# EAGLE design IRDetector (EAGLE 7.5.0)
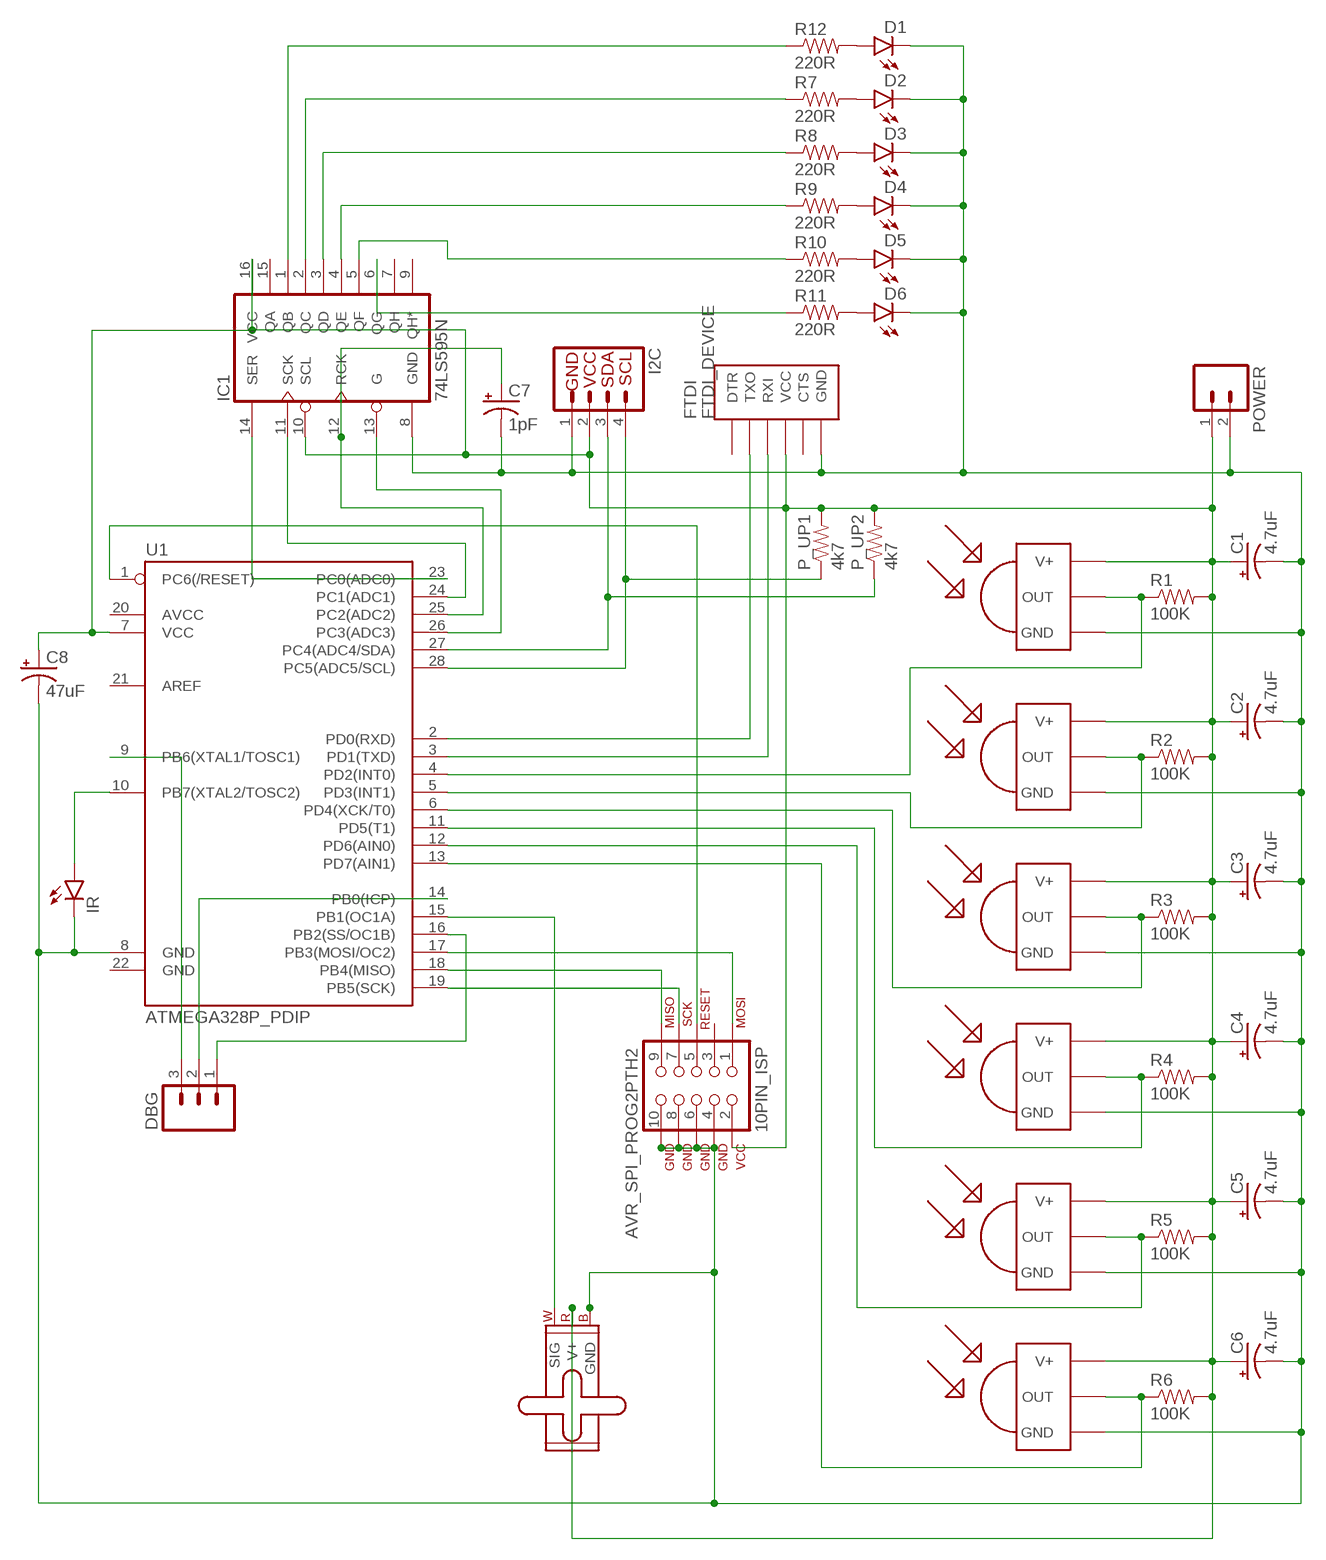
[diagram p0: schematic, sheet 1]

## Parts
10PIN_ISP  AVR_SPI_PROG2PTH2  [2X5-SHROUDED]
C1  4.7uF  CAP_POLPTH2  [CPOL-RADIAL-10UF-25V]
C2  4.7uF  CAP_POLPTH2  [CPOL-RADIAL-10UF-25V]
C3  4.7uF  CAP_POLPTH2  [CPOL-RADIAL-10UF-25V]
C4  4.7uF  CAP_POLPTH2  [CPOL-RADIAL-10UF-25V]
C5  4.7uF  CAP_POLPTH2  [CPOL-RADIAL-10UF-25V]
C6  4.7uF  CAP_POLPTH2  [CPOL-RADIAL-10UF-25V]
C7  1pF  CAP_POLPTH2  [CPOL-RADIAL-10UF-25V]
C8  47uF  CAP_POLPTH2  [CPOL-RADIAL-10UF-25V]
D1  LED5MM  [LED5MM]
D2  LED5MM  [LED5MM]
D3  LED5MM  [LED5MM]
D4  LED5MM  [LED5MM]
D5  LED5MM  [LED5MM]
D6  LED5MM  [LED5MM]
DBG  M03PTH  [1X03]
FTDI  FTDI_DEVICE  [FTDI_DEVICE_SIDE]
I2C  I2C_STANDARD  [1X04]
IC1  74LS595N  [DIL16]
IR  LED5MM  [LED5MM]
IRD1  TSOP4838  [TSOP18XX]
IRD2  TSOP4838  [TSOP18XX]
IRD3  TSOP4838  [TSOP18XX]
IRD4  TSOP4838  [TSOP18XX]
IRD5  TSOP4838  [TSOP18XX]
IRD6  TSOP4838  [TSOP18XX]
M1  SMALL_SERVO  [1X03]
P_UP1  4k7  RESISTORPTH-1/6W  [1/6W-RES]
P_UP2  4k7  RESISTORPTH-1/6W  [1/6W-RES]
POWER  M02JST-PTH-VERT  [JST-2-PTH-VERT]
R1  100K  RESISTORPTH-1/6W  [1/6W-RES]
R2  100K  RESISTORPTH-1/6W  [1/6W-RES]
R3  100K  RESISTORPTH-1/6W  [1/6W-RES]
R4  100K  RESISTORPTH-1/6W  [1/6W-RES]
R5  100K  RESISTORPTH-1/6W  [1/6W-RES]
R6  100K  RESISTORPTH-1/6W  [1/6W-RES]
R7  220R  RESISTORPTH-1/6W  [1/6W-RES]
R8  220R  RESISTORPTH-1/6W  [1/6W-RES]
R9  220R  RESISTORPTH-1/6W  [1/6W-RES]
R10  220R  RESISTORPTH-1/6W  [1/6W-RES]
R11  220R  RESISTORPTH-1/6W  [1/6W-RES]
R12  220R  RESISTORPTH-1/6W  [1/6W-RES]
U1  ATMEGA328P_PDIP  [DIL28-3]

## Nets
N$1: 10PIN_ISP.4(GND) 10PIN_ISP.6(GND) 10PIN_ISP.8(GND) 10PIN_ISP.10(GND) C1.2(-) C2.2(-) C3.2(-) C4.2(-) C5.2(-) C6.2(-) C7.2(-) C8.2(-) D1.K(C) D2.K(C) D3.K(C) D4.K(C) D5.K(C) D6.K(C) FTDI.P$6(GND) I2C.1 IC1.8(GND) IR.K(C) IRD1.GND IRD2.GND IRD3.GND IRD4.GND IRD5.GND IRD6.GND M1.3(GND) POWER.2 U1.8(GND)
N$2: 10PIN_ISP.2(VCC) C1.1(+) C2.1(+) C3.1(+) C4.1(+) C5.1(+) C6.1(+) C8.1(+) FTDI.P$4(VCC) I2C.2 IC1.10(SCL) IC1.16(VCC) IRD1.VCC(V+) IRD2.VCC(V+) IRD3.VCC(V+) IRD4.VCC(V+) IRD5.VCC(V+) IRD6.VCC(V+) M1.2(V+) P_UP1.2 P_UP2.2 POWER.1 R1.2 R2.2 R3.2 R4.2 R5.2 R6.2 U1.7(VCC)
N$3: IRD1.OUT R1.1 U1.4(PD2(INT0))
N$4: IRD2.OUT R2.1 U1.5(PD3(INT1))
N$5: IRD3.OUT R3.1 U1.6(PD4(XCK/T0))
N$6: IRD4.OUT R4.1 U1.11(PD5(T1))
N$7: IRD5.OUT R5.1 U1.12(PD6(AIN0))
N$8: IRD6.OUT R6.1 U1.13(PD7(AIN1))
N$9: FTDI.P$2(TXO) U1.2(PD0(RXD))
N$10: FTDI.P$3(RXI) U1.3(PD1(TXD))
N$11: 10PIN_ISP.5(RESET) U1.1(PC6(/RESET))
N$12: 10PIN_ISP.9(MISO) U1.18(PB4(MISO))
N$13: 10PIN_ISP.1(MOSI) U1.17(PB3(MOSI/OC2))
N$14: M1.1(SIG) U1.15(PB1(OC1A))
N$15: 10PIN_ISP.7(SCK) U1.19(PB5(SCK))
N$16: IC1.13(G) U1.26(PC3(ADC3))
N$17: C7.1(+) IC1.12(RCK) U1.25(PC2(ADC2))
N$18: IC1.11(SCK) U1.24(PC1(ADC1))
N$19: IC1.1(QB) R12.1
N$20: IC1.14(SER) U1.23(PC0(ADC0))
N$21: I2C.4 P_UP1.1 U1.28(PC5(ADC5/SCL))
N$22: I2C.3 P_UP2.1 U1.27(PC4(ADC4/SDA))
N$23: IC1.2(QC) R7.1
N$24: IC1.3(QD) R8.1
N$25: IC1.4(QE) R9.1
N$26: D1.A R12.2
N$27: D2.A R7.2
N$28: D3.A R8.2
N$29: D4.A R9.2
N$30: D5.A R10.2
N$31: D6.A R11.2
N$32: IR.A U1.10(PB7(XTAL2/TOSC2))
N$33: DBG.1 U1.16(PB2(SS/OC1B))
N$34: DBG.2 U1.14(PB0(ICP))
N$35: IC1.5(QF) R10.1
N$36: IC1.6(QG) R11.1
N$37: DBG.3 U1.9(PB6(XTAL1/TOSC1))
Unconnected: 10PIN_ISP.3(NC) FTDI.P$1(DTR) FTDI.P$5(CTS) IC1.7(QH) IC1.9(QH*) IC1.15(QA) U1.20(AVCC) U1.21(AREF) U1.22(GND)

## Library data of the parts
10PIN_ISP = SparkFun-Connectors:AVR_SPI_PROG2: AVR 10-pin ICSP Header This is the standard AVR In Circuit Serial Programming header. Minimal, but includes pin one indicator. Works with standard Olimex programmers. Also look for the 6-pin reduced version. Spark Fun Electronics SKU: PRT-00778
C1-C8 = SparkFun-Capacitors:CAP_POL: Capacitor Polarized These are standard SMD and PTH capacitors. Normally 10uF, 47uF, and 100uF in electrolytic and tantalum varieties. Always verify the external diameter of the through hole cap, it varies with capacity, voltage, and manufacturer. The EIA devices should be standard.
D1-D6 IR = SparkFun-LED:LED: LEDs Standard schematic elements and footprints for 5mm, 3mm, 1206, and 0603 sized LEDs. 5mm - Spark Fun Electronics SKU : COM-00529 (and others)
DBG = SparkFun-Connectors:M03: Header 3 Standard 3-pin 0.1" header. Use with straight break away headers (SKU : PRT-00116), right angle break away headers (PRT-00553), swiss pins (PRT-00743), machine pins (PRT-00117), and female headers (PRT-00115). Molex polarized connector foot print use with SKU : PRT-08232 with associated crimp pins and housings.
FTDI = SparkFun-Connectors:FTDI_DEVICE: Connector which mates to FTDI basic or FTDI cable.
I2C = SparkFun-Connectors:I2C_STANDARD: SparkFun has standardized on a pinout for all I2C based sensor breakouts. This pinout allows I2C boards to be plugged directly into the headers on Arduino Uno compatible boards, and to be daisy chained easily.
IC1 = SparkFun-DigitalIC:74*595: 8-bit SHIFT REGISTER, output latch
IRD1-IRD6 = tsop:TSOP4838: IR Receiver and Demodulator
M1 = SparkFun-Electromechanical:SMALL_SERVO: Small servo motor This is the small servo used in the SIK. SKU: ROB-09065
P_UP1 P_UP2 R1-R12 = SparkFun-Resistors:RESISTOR: Resistor Basic schematic elements and footprints for 0603, 1206, and PTH resistors.
POWER = SparkFun-Connectors:M02: Standard 2-pin 0.1" header. Use with - straight break away headers ( PRT-00116) - right angle break away headers (PRT-00553) - swiss pins (PRT-00743) - machine pins (PRT-00117) - female headers (PRT-00115) Molex polarized connector foot print use with: PRT-08233 with associated crimp pins and housings. 2.54_SCREWTERM for use with PRT-10571. 3.5mm Screw Terminal footprints for PRT-08084 5mm Screw Terminal footprints for use with PRT-08432
U1 = SparkFun-DigitalIC:ATMEGA328P_PDIP: uC used in the Arduino 32kb flash, 1k EEPROM, 2k SRAM This is the through-hole version of this chip.

## Board
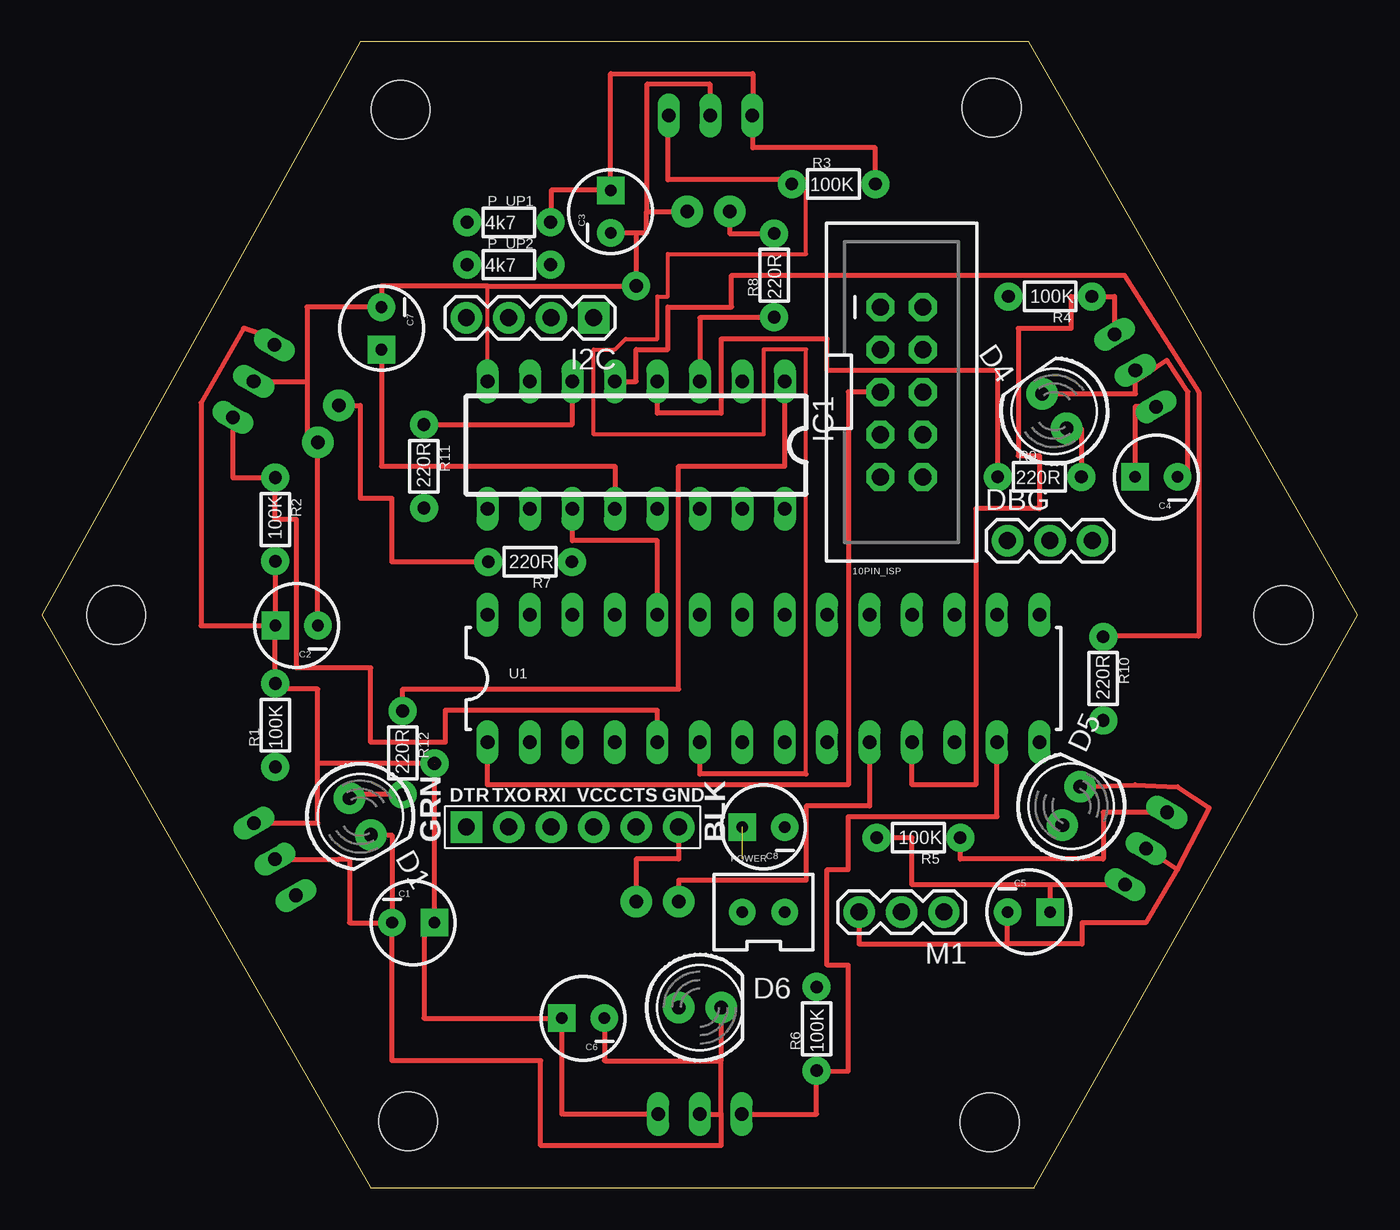
[diagram p1: board, top side]
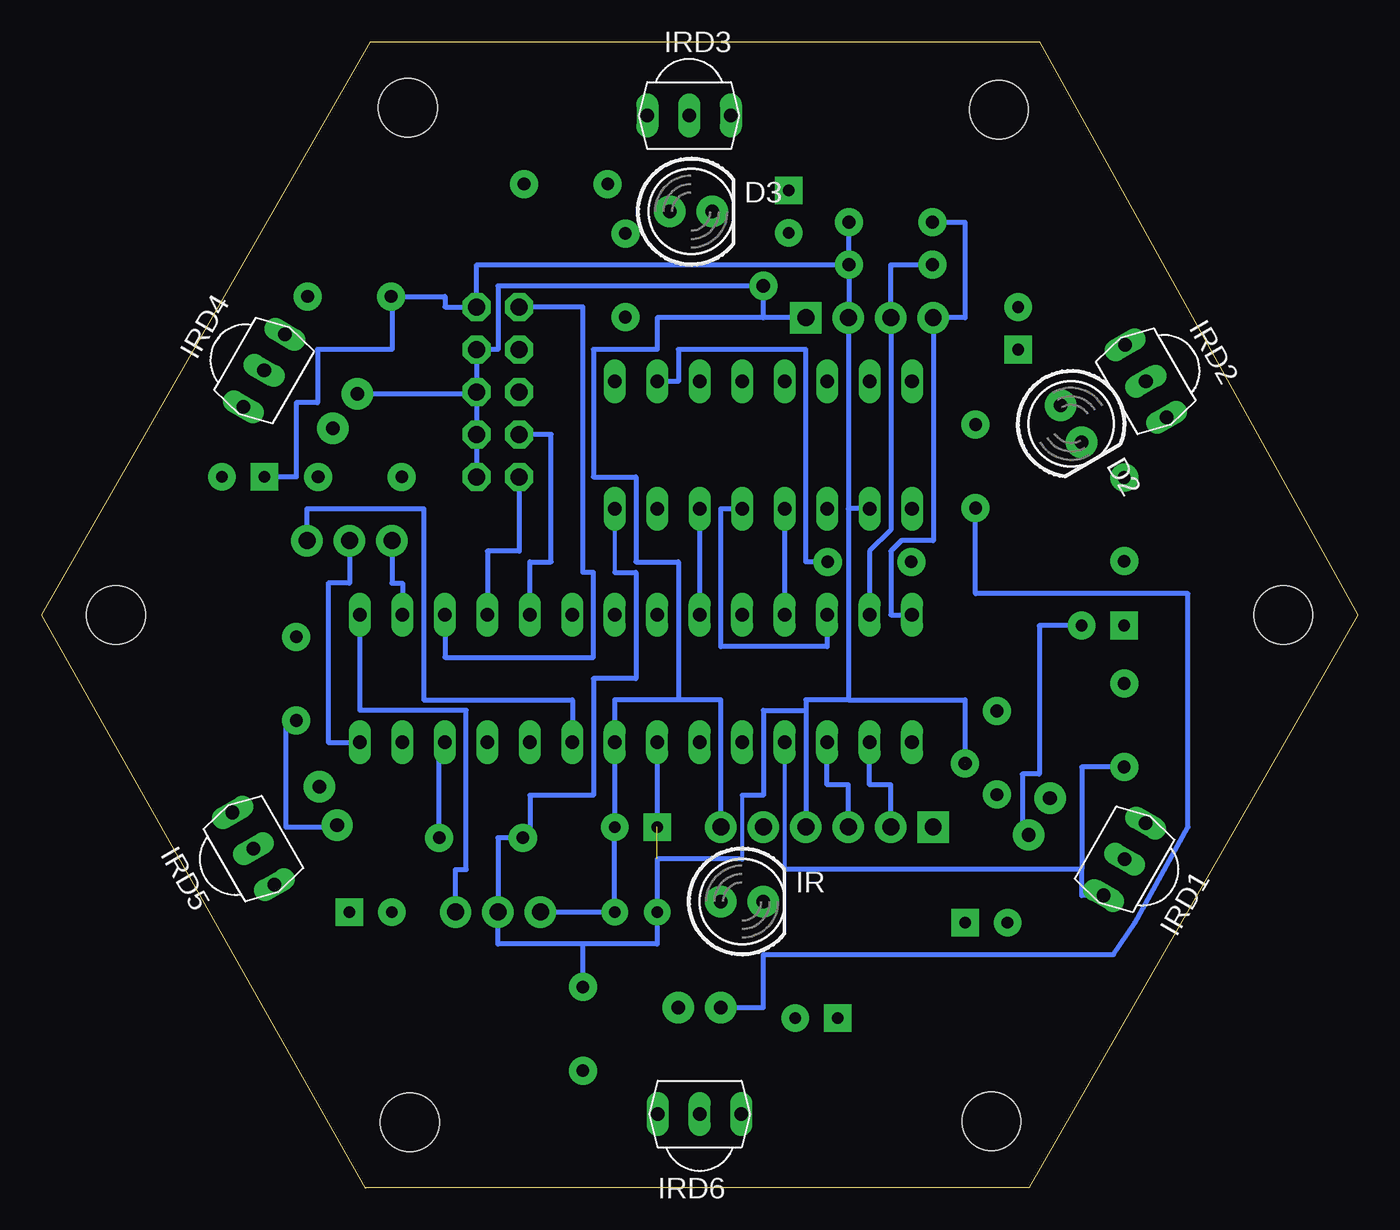
[diagram p2: board, bottom side, seen from below]

Size 78.73 x 68.59 mm. Coordinates in mm from the lower left corner, seen from the top.
Outline: 19.05,68.59 59.05,68.59 78.73,34.29 59.36,0 59.36,0.01 19.68,0.01 0,34.29 19.04,68.58
Copper layers (1*16): Top 0.035mm / dielectric 1.5mm / Bottom 0.035mm
Design rules "default": minimum track width 10mil, minimum drill 24mil, track to track 8mil, track to pad 8mil, pad to pad 8mil, via to via 8mil, smd to smd 8mil, copper to edge 40mil, drill to drill 8mil, minimum pad ring 10mil, minimum via ring 8mil, stop-mask expansion 4mil, vias tented up to drill 0mil, thermal gap 10mil
Holes 3.5 mm at 4.45,34.3 74.29,34.3 21.46,64.53 56.83,64.65 56.71,3.95 21.91,4.01

### Footprints (pad centres in the part's own frame; a part is rotated, then mirrored left to right if it is on the bottom)
2X5-SHROUDED = drill 1.016 pad 1.676 octagon: 1 -1.27,5.08; 2 1.27,5.08; 3 -1.27,2.54; 4 1.27,2.54; 5 -1.27,0; 6 1.27,0; 7 -1.27,-2.54; 8 1.27,-2.54; 9 -1.27,-5.08; 10 1.27,-5.08
CPOL-RADIAL-10UF-25V = drill 0.7 pad 1.651 square: 1 1.27,0 | drill 0.7 pad 1.651: 2 -1.27,0
LED5MM = drill 0.813 pad 1.88: A -1.27,0; K 1.27,0
1X03 = drill 1.016 pad 1.88: 1 0,0; 2 2.54,0; 3 5.08,0
FTDI_DEVICE_SIDE = drill 1.016 pad 1.88 square: P$1 -6.35,0 | drill 1.016 pad 1.88: P$2 -3.81,0; P$3 -1.27,0; P$4 1.27,0; P$5 3.81,0; P$6 6.35,0
1X04 = drill 1.016 pad 1.88 square: 1 0,0 | drill 1.016 pad 1.88: 2 2.54,0; 3 5.08,0; 4 7.62,0
DIL16 = drill 0.813 long: 1 -8.89,-3.81; 2 -6.35,-3.81; 3 -3.81,-3.81; 4 -1.27,-3.81; 5 1.27,-3.81; 6 3.81,-3.81; 7 6.35,-3.81; 8 8.89,-3.81; 9 8.89,3.81; 10 6.35,3.81; 11 3.81,3.81; 12 1.27,3.81; 13 -1.27,3.81; 14 -3.81,3.81; 15 -6.35,3.81; 16 -8.89,3.81
TSOP18XX = drill 0.813 long: GND -0.001,-0.027; OUT -2.501,-0.027; VCC 2.499,-0.027
1/6W-RES = drill 0.762 pad 1.676: 1 -2.5,0; 2 2.5,0
JST-2-PTH-VERT = drill 0.7 pad 1.6: 1 -1.27,0; 2 1.27,0
DIL28-3 = drill 0.813 long: 1 -16.51,-3.81; 2 -13.97,-3.81; 3 -11.43,-3.81; 4 -8.89,-3.81; 5 -6.35,-3.81; 6 -3.81,-3.81; 7 -1.27,-3.81; 8 1.27,-3.81; 9 3.81,-3.81; 10 6.35,-3.81; 11 8.89,-3.81; 12 11.43,-3.81; 13 13.97,-3.81; 14 16.51,-3.81; 15 16.51,3.81; 16 13.97,3.81; 17 11.43,3.81; 18 8.89,3.81; 19 6.35,3.81; 20 3.81,3.81; 21 1.27,3.81; 22 -1.27,3.81; 23 -3.81,3.81; 24 -6.35,3.81; 25 -8.89,3.81; 26 -11.43,3.81; 27 -13.97,3.81; 28 -16.51,3.81

### Placement (x,y rotation side)
10PIN_ISP  51.44,47.63 0 top
C1  22.23,15.88 0 top
C2  15.24,33.66 180 top
C3  34.04,58.43 90 top
C4  66.68,42.55 180 top
C5  59.05,16.52 0 top
C6  32.38,10.17 180 top
C7  20.32,51.45 270 top
C8  43.18,21.6 180 top
D1  19.05,22.23 300 top
D2  17.14,45.73 300 bottom
D3  39.88,58.43 0 bottom
D4  60.58,46.49 125 top
D5  61.6,22.87 65 top
D6  39.37,10.81 0 top
DBG  57.79,38.74 0 top
FTDI  31.75,21.6 0 top
I2C  33.02,52.08 180 top
IC1  35.56,44.46 180 top
IR  36.83,17.16 0 bottom
IRD1  13.97,19.7 60 bottom
IRD2  12.7,48.27 120 bottom
IRD3  40.01,64.15 180 bottom
IRD4  65.41,48.91 240 bottom
IRD5  66.04,20.33 300 bottom
IRD6  39.37,4.46 0 bottom
M1  53.98,16.52 180 top
P_UP1  27.94,57.79 0 top
P_UP2  27.94,55.25 0 top
POWER  43.18,16.52 0 top
R1  13.97,27.7 90 top
R2  13.97,40.02 270 top
R3  47.37,60.08 0 top
R4  60.32,53.35 180 top
R5  52.45,20.97 180 top
R6  46.35,9.54 90 top
R7  29.21,37.48 180 top
R8  43.81,54.62 90 top
R9  59.69,42.55 0 top
R10  63.5,30.49 270 top
R11  22.86,43.19 270 top
R12  21.59,26.05 270 top
U1  43.18,30.49 0 top

### Tracks (layer width: path | path; a pad name or v marks a point on that pad's centre or on a via)
N$1  (via drill 0.8 pad 1.68)
  Top 0.254: IC1.8 26.67,53.98
  Top 0.305: IRD3.GND 40,66.05 | 40,66.05 40.01,66.05 | 40,66.05 36.2,66.05 36.2,58.43 | 36.2,58.43 D3.K | 35.56,57.16 36.2,57.16 36.2,58.43 | C3.2 35.56,57.16 | 35.56,57.16 v35.56,53.98 26.67,53.98 20.32,53.98 C7.2 15.88,52.71 15.88,48.27 | IRD2.GND 12.68,48.27 15.88,48.27 | 15.88,48.27 15.88,44.63 D2.K C2.2 | D1.K 20.95,21.13 C1.2 | IRD1.GND 17.78,19.68 17.78,19.7 18.41,19.7 18.41,15.88 C1.2 | IRD6.GND 40.64,4.43 | 40.64,4.43 40.64,7.63 | C6.2 33.66,7.63 40.64,7.63 | D6.K 40.64,7.63 | 40.64,4.43 40.64,2.55 29.84,2.55 29.84,7.63 20.95,7.63 C1.2 | 57.79,14.62 62.23,14.62 62.23,15.88 66.04,15.88 67.94,19.06 | 57.79,14.62 C5.2 | D5.K 65.41,24.14 67.94,24.02 69.85,22.75 67.94,19.06 | IRD5.GND 66.06,20.33 67.94,19.06 | D4.K 65.43,47.53 65.43,48.27 | 65.43,48.27 IRD4.GND | M1.3 48.9,14.62 57.79,14.62 | FTDI.P$6 38.1,19.7 35.56,19.7 IR.K | C4.2 68.58,42.55 68.58,47.63 67.31,49.54 65.43,48.27
  Bottom 0.305: FTDI.P$6 38.1,29.22 40.64,29.22 | 40.64,29.22 44.45,29.22 U1.8 C8.2 POWER.2 M1.3 | 10PIN_ISP.6 10PIN_ISP.4 51.44,50.17 51.44,53.98 v35.56,53.98 35.56,52.08 | 10PIN_ISP.6 10PIN_ISP.8 10PIN_ISP.10 | 40.64,29.22 40.64,37.48 43.18,37.48 43.18,42.55 45.72,42.55 45.72,50.17 41.91,50.17 41.91,52.08 35.56,52.08 | I2C.1 35.56,52.08 | C2.2 19.05,33.66 19.05,24.77 20.07,24.77 20.07,21.13 D1.K | D4.K 52.71,47.53 10PIN_ISP.6
N$2  (2 unrouted)
  Top 0.305: R3.2 49.87,62.24 42.55,62.24 42.55,64.17 | 42.55,64.17 42.55,66.69 34.04,66.69 C3.1 30.48,59.7 30.48,57.79 P_UP1.2 | 42.55,64.17 IRD3.VCC | IRD2.VCC 13.93,50.81 12.07,51.45 9.52,47 9.52,33.66 C2.1 | R2.2 C2.1 | C2.1 R1.2 13.97,29.85 16.51,29.85 16.51,25.41 | IRD1.VCC 16.51,21.85 16.51,25.41 | IRD6.VCC 31.12,4.43 C6.1 22.86,10.17 22.86,15.88 C1.1 23.49,25.41 16.51,25.41 | C5.1 60.32,18.15 IRD5.VCC 52.07,18.15 52.07,20.97 R5.2 | IRD4.VCC 65.41,46.75 C4.1
  Bottom 0.254: 36.83,23.51 36.83,19.7 | IC1.16 44.45,36.84
  Bottom 0.305: U1.7 C8.1 | 36.83,23.51 35.56,23.51 35.56,28.59 33.02,28.59 | 36.83,19.7 41.91,19.7 POWER.1 41.91,14.62 46.35,14.62 | 44.45,36.84 43.18,36.84 43.18,30.49 45.72,30.49 45.72,23.51 49.53,23.51 49.53,20.97 R5.2 51.44,20.97 M1.2 51.44,14.62 46.35,14.62 | 30.48,40.65 I2C.2 30.44,51.45 P_UP2.2 | 30.48,40.65 30.48,29.22 | 30.48,29.22 33.02,29.22 33.02,28.59 | 33.02,28.59 FTDI.P$4 | P_UP2.2 P_UP1.2 | P_UP2.2 52.71,55.25 10PIN_ISP.2 54.61,52.71 54.61,53.35 57.79,53.35 | 30.48,29.22 23.49,29.22 23.49,25.41 | R6.2 46.35,14.62 | R4.2 57.79,53.35 | 57.79,53.35 57.79,50.17 62.23,50.17 62.23,47 63.5,47 63.5,42.55 C4.1 | IC1.10 30.48,40.65
N$3
  Bottom 0.254: U1.4 34.29,19.06
  Bottom 0.305: R1.1 16.51,25.2 16.51,19.06 | 16.51,19.06 34.29,19.06 | IRD1.OUT 16.51,17.52 16.51,19.06
N$4
  Top 0.305: IRD2.OUT 11.43,42.52 R2.1 13.97,40.02 15.24,40.02 15.24,31.12 19.68,31.12 19.68,26.68 24.13,26.68 24.13,28.59 36.83,28.59 U1.5
N$5
  Top 0.254: 45.72,24.77 45.72,50.17 43.18,50.17 43.18,45.09 33.02,45.09 33.02,50.17 34.29,50.17 34.92,50.81 36.83,50.81 36.83,53.35 37.47,53.35 37.47,55.89 45.72,55.89 45.72,60.34 44.45,60.34
  Top 0.305: 44.87,60.34 44.45,60.34 37.47,60.34 37.47,64.17 IRD3.OUT | R3.1 44.87,60.34 | 44.87,60.34 45.72,60.34 | 45.72,24.77 39.37,24.77 U1.6
N$6
  Top 0.305: IRD4.OUT 64.18,53.35 R4.1 61.6,53.35 61.6,51.45 58.42,51.45 58.42,43.82 59.69,43.82 59.69,40.65 55.88,40.65 55.88,24.14 52.07,24.14 U1.11
N$7
  Top 0.305: IRD5.OUT 63.5,22.48 63.5,19.7 54.95,19.7 R5.1
  Bottom 0.305: R5.1 54.95,26.68 U1.12
N$8
  Top 0.305: IRD6.OUT 46.35,4.43 R6.1 46.99,7.04 48.26,7 48.26,13.35 46.99,13.35 46.99,19.06 48.26,19.06 48.26,22.23 57.15,22.23 U1.13
N$9
  Bottom 0.305: FTDI.P$2 27.94,24.14 29.21,24.14 U1.2
N$10
  Bottom 0.305: FTDI.P$3 30.48,24.14 31.75,24.14 U1.3
N$11
  Top 0.305: 10PIN_ISP.5 48.26,47.63 48.26,24.14 26.67,24.14 U1.1
N$12
  Bottom 0.305: 10PIN_ISP.9 50.16,38.11 52.07,38.11 U1.18
N$13
  Bottom 0.305: U1.17 54.61,31.76 45.72,31.76 45.72,36.84 46.35,36.84 46.35,52.71 10PIN_ISP.1
N$14
  Bottom 0.305: M1.1 53.98,19.06 53.34,19.06 53.34,28.59 59.69,28.59 U1.15
N$15
  Bottom 0.305: U1.19 49.53,37.48 48.26,37.48 48.26,45.09 10PIN_ISP.7
N$16
  Bottom 0.305: U1.26 31.75,32.39 38.1,32.39 38.1,40.65 IC1.13
N$17
  Top 0.305: C7.1 20.32,43.19 34.29,43.19 IC1.12
  Bottom 0.305: IC1.12 U1.25
N$18
  Top 0.305: U1.24 36.83,38.74 31.75,38.74 IC1.11
N$19
  Top 0.305: R12.1 21.59,29.85 38.1,29.85 38.1,43.19 44.45,43.19 IC1.1
N$20
  Bottom 0.305: IC1.14 U1.23
N$21
  Bottom 0.305: U1.28 27.94,34.3 27.94,38.11 27.3,38.74 25.4,38.74 I2C.4 23.49,52.08 23.49,57.79 P_UP1.1
N$22
  Bottom 0.305: U1.27 29.21,38.11 27.94,39.38 I2C.3 27.94,55.25 P_UP2.1
N$23
  Bottom 0.305: R7.1 33.02,37.48 33.02,50.17 40.64,50.17 40.64,48.27 IC1.2
N$24
  Top 0.305: R8.1 43.81,52.08 39.37,52.08 IC1.3
N$25
  Top 0.305: R9.1 57.19,48.91 46.99,48.91 46.99,50.81 40.64,50.81 40.64,46.37 36.83,46.37 IC1.4
N$26
  Top 0.305: R12.2 18.41,23.55 D1.A
N$27
  Top 0.305: D2.A 19.05,46.83 19.05,46.37 19.05,41.28 20.95,41.28 20.95,37.48 R7.2
N$28
  Top 0.305: D3.A 41.15,57.12 R8.2
N$29
  Top 0.305: D4.A 62.19,45.45 R9.2
N$30
  Bottom 0.305: R10.2 64.13,27.99 64.13,21.6 61.06,21.6 D5.A
N$31
  Bottom 0.305: D6.A 35.56,10.81 35.56,13.98 14.61,13.98 13.34,15.88 10.16,21.6 10.16,35.57 22.86,35.57 R11.2
N$32
  Top 0.305: U1.10 49.53,22.87 45.72,22.87 45.72,18.42 38.1,18.42 IR.A
N$33
  Bottom 0.305: DBG.1 57.79,36.2 57.15,36.2 U1.16
N$34
  Bottom 0.305: DBG.2 60.32,36.2 61.6,36.2 61.6,26.68 U1.14
N$35
  Top 0.305: IC1.5 35.56,48.27 35.56,50.17 37.47,50.17 37.47,52.71 41.27,52.71 41.27,54.62 64.77,54.62 69.22,47.63 69.22,33.03 63.5,33.03 R10.1
N$36
  Top 0.305: R11.1 31.75,45.69 IC1.6
N$37
  Bottom 0.305: DBG.3 62.87,40.65 55.88,40.65 55.88,29.22 46.99,29.22 U1.9
N$38  (via drill 0.8 pad 1.68)
  other vias: 23.49,25.41